# Altium project SmallKeyboard_Project.PrjPcb
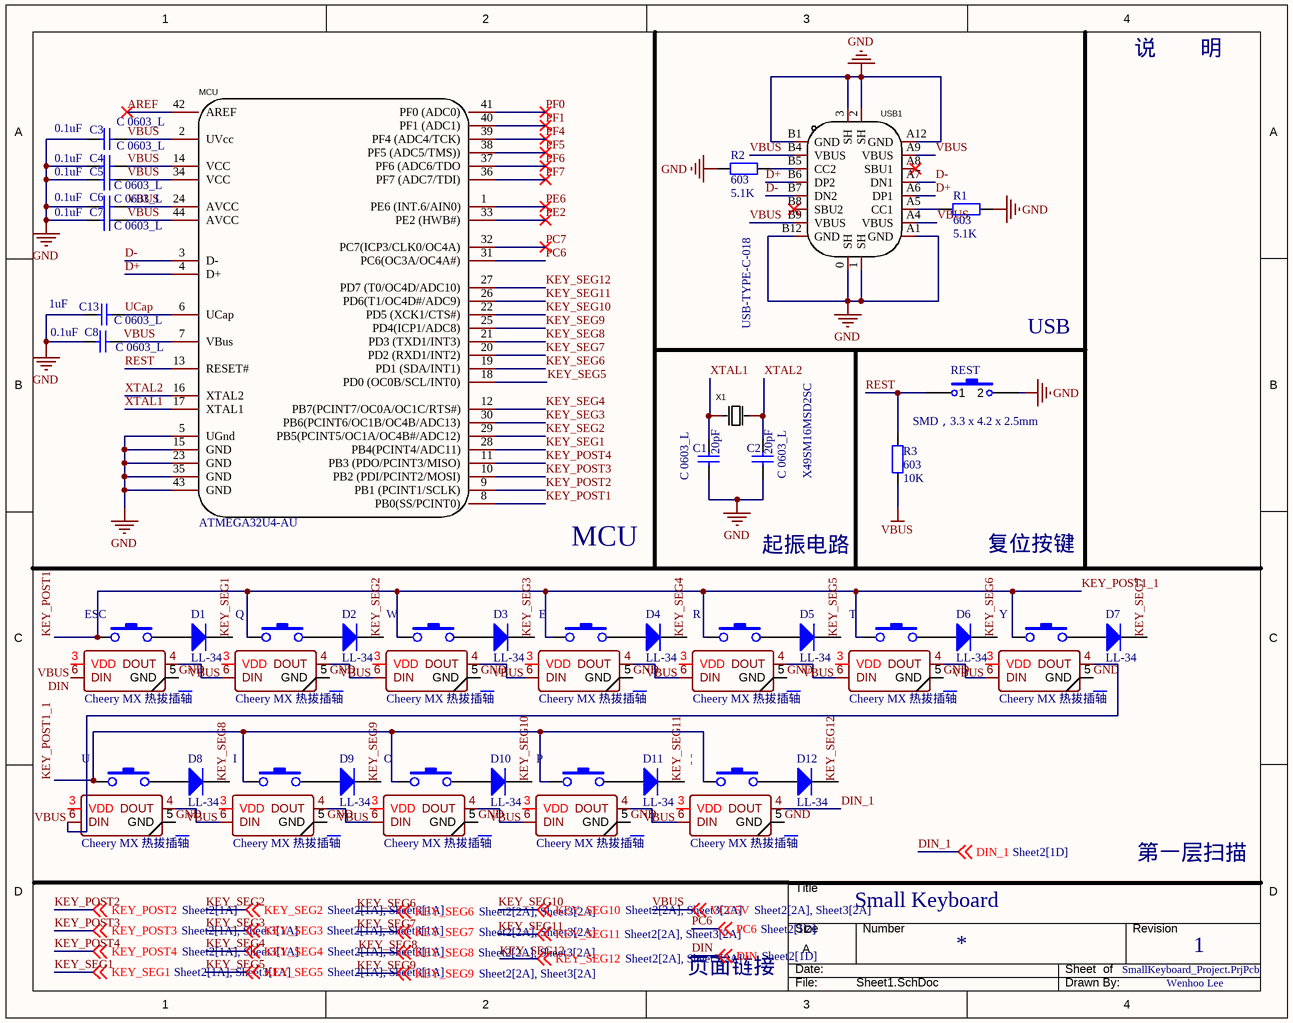
[diagram p0: Sheet1.SchDoc]
3 sheets, 114 parts. Net scope: global (net labels, ports and power ports of the same name join across sheets).
Board file: PCB1.PcbDoc
Sheets:
  Sheet1.SchDoc
  Sheet2.SchDoc
  Sheet3.SchDoc

## Sheet Sheet1.SchDoc: Small Keyboard
size A; ApprovedBy: Wenhoo Lee; CheckedBy: Wenhoo Lee; Author: Wenhoo Lee; CompanyName: Coreduino; DrawnBy: Wenhoo Lee; Engineer: Wenhoo Lee; Organization: Coreduino; Address1: Shandong; Address2: Taian; Address3: Dongping; Address4: Wangshan No.03; DocumentNumber: 1; Revision: 1; SheetNumber: 1; SheetTotal: 2

### Parts
C1  C 0603_L  value 20pF  [C 0603_L]
C2  C 0603_L  value 20pF  [C 0603_L]
C3  C 0603_L  value 0.1uF  [C 0603_L]
C4  C 0603_L  value 0.1uF  [C 0603_L]
C5  C 0603_L  value 0.1uF  [C 0603_L]
C6  C 0603_L  value 0.1uF  [C 0603_L]
C7  C 0603_L  value 0.1uF  [C 0603_L]
C8  C 0603_L  value 0.1uF  [C 0603_L]
C13  C 0603_L  value 1uF  [C 0603_L]
D1  LL-34  [LL-34_L3.7-W1.6-RD]
D2  LL-34  [LL-34_L3.7-W1.6-RD]
D3  LL-34  [LL-34_L3.7-W1.6-RD]
D4  LL-34  [LL-34_L3.7-W1.6-RD]
D5  LL-34  [LL-34_L3.7-W1.6-RD]
D6  LL-34  [LL-34_L3.7-W1.6-RD]
D7  LL-34  [LL-34_L3.7-W1.6-RD]
D8  LL-34  [LL-34_L3.7-W1.6-RD]
D9  LL-34  [LL-34_L3.7-W1.6-RD]
D10  LL-34  [LL-34_L3.7-W1.6-RD]
D11  LL-34  [LL-34_L3.7-W1.6-RD]
D12  LL-34  [LL-34_L3.7-W1.6-RD]
E  Cheery MX 热拔插轴  [MX_SW-HOTPLUG]
ESC  Cheery MX 热拔插轴  [MX_SW-HOTPLUG]
I  Cheery MX 热拔插轴  [MX_SW-HOTPLUG]
MCU  ATMEGA32U4-AU  [QFP-44_L10.0-W10.0-P0.80-LS13.2-BL]
O  Cheery MX 热拔插轴  [MX_SW-HOTPLUG]
P  Cheery MX 热拔插轴  [MX_SW-HOTPLUG]
Q  Cheery MX 热拔插轴  [MX_SW-HOTPLUG]
R  Cheery MX 热拔插轴  [MX_SW-HOTPLUG]
R1  603  value 5.1K  [0603P]
R2  603  value 5.1K  [0603P]
R3  603  value 10K  [R 0603_L]
REST  SMD，3.3 x 4.2 x 2.5mm  [SMD-3.2*4.2]
T  Cheery MX 热拔插轴  [MX_SW-HOTPLUG]
U  Cheery MX 热拔插轴  [MX_SW-HOTPLUG]
USB1  USB-TYPE-C-018  [USB-C_SMD-TYPE-C-31-M-12]
W  Cheery MX 热拔插轴  [MX_SW-HOTPLUG]
X1  X49SM16MSD2SC  [HC-49S_L11.4-W4.8]
Y  Cheery MX 热拔插轴  [MX_SW-HOTPLUG]
|  Cheery MX 热拔插轴  [MX_SW-HOTPLUG]

### Nets
GND: C1.1 C2.1 C3.1 C4.1 C5.1 C6.1 C7.1 C8.1 C13.1 E.5(GND) ESC.5(GND) I.5(GND) MCU.5(UGnd) MCU.15(GND) MCU.23(GND) MCU.35(GND) MCU.43(GND) O.5(GND) P.5(GND) Q.5(GND) R.5(GND) R1.2 R2.1 REST.2 T.5(GND) U.5(GND) USB1.0(SH) USB1.1(SH) USB1.2(SH) USB1.3(SH) USB1.A1(GND) USB1.A12(GND) USB1.B1(GND) USB1.B12(GND) W.5(GND) Y.5(GND) |.5(GND)
VBUS: C3.2 C4.2 C5.2 C6.2 C7.2 C8.2 E.3(VDD) ESC.3(VDD) I.3(VDD) MCU.2(UVcc) MCU.7(VBus) MCU.14(VCC) MCU.24(AVCC) MCU.34(VCC) MCU.44(AVCC) O.3(VDD) P.3(VDD) Q.3(VDD) R.3(VDD) R3.1 T.3(VDD) U.3(VDD) USB1.A4(VBUS) USB1.A9(VBUS) USB1.B4(VBUS) USB1.B9(VBUS) W.3(VDD) Y.3(VDD) |.3(VDD) ; off-sheet VCC5V  [also labelled VCC5V]
AREF: MCU.42(AREF)
D+: MCU.4(D+) USB1.A6(DP1) USB1.B6(DP2)
D-: MCU.3(D-) USB1.A7(DN1) USB1.B7(DN2)
DIN: ESC.6(DIN) ; off-sheet DIN
DIN_1: |.4(DOUT) ; off-sheet DIN_1
KEY_POST1: E.1 ESC.1 I.1 MCU.8(PB0(SS/PCINT0)) O.1 P.1 Q.1 R.1 T.1 U.1 W.1 Y.1 |.1  [also labelled KEY_POST1_1]
KEY_POST2: MCU.9(PB1_(PCINT1/SCLK)) ; off-sheet KEY_POST2
KEY_POST3: MCU.10(PB2_(PDI/PCINT2/MOSI)) ; off-sheet KEY_POST3
KEY_POST4: MCU.11(PB3_(PDO/PCINT3/MISO)) ; off-sheet KEY_POST4
KEY_SEG1: D1.2(K) MCU.28(PB4(PCINT4/ADC11)) ; off-sheet KEY_SEG1
KEY_SEG2: D2.2(K) MCU.29(PB5(PCINT5/OC1A/OC4B#/ADC12)) ; off-sheet KEY_SEG2
KEY_SEG3: D3.2(K) MCU.30(PB6(PCINT6/OC1B/OC4B/ADC13)) ; off-sheet KEY_SEG3
KEY_SEG4: D4.2(K) MCU.12(PB7(PCINT7/OC0A/OC1C/RTS#)) ; off-sheet KEY_SEG4
KEY_SEG5: D5.2(K) MCU.18(PD0_(OC0B/SCL/INT0)) ; off-sheet KEY_SEG5
KEY_SEG6: D6.2(K) MCU.19(PD1_(SDA/INT1)) ; off-sheet KEY_SEG6
KEY_SEG7: D7.2(K) MCU.20(PD2_(RXD1/INT2)) ; off-sheet KEY_SEG7
KEY_SEG8: D8.2(K) MCU.21(PD3_(TXD1/INT3)) ; off-sheet KEY_SEG8
KEY_SEG9: D9.2(K) MCU.25(PD4(ICP1/ADC8)) ; off-sheet KEY_SEG9
KEY_SEG10: D10.2(K) MCU.22(PD5_(XCK1/CTS#)) ; off-sheet KEY_SEG10
KEY_SEG11: D11.2(K) MCU.26(PD6(T1/OC4D#/ADC9)) ; off-sheet KEY_SEG11
KEY_SEG12: D12.2(K) MCU.27(PD7_(T0/OC4D/ADC10)) ; off-sheet KEY_SEG12
PC6: MCU.31(PC6(OC3A/OC4A#)) ; off-sheet PC6  [project net DIN_3V3_1(PC6)]
PC7: MCU.32(PC7(ICP3/CLK0/OC4A))
PE2: MCU.33(PE2_(HWB#))
PE6: MCU.1(PE6_(INT.6/AIN0))
PF0: MCU.41(PF0_(ADC0))
PF1: MCU.40(PF1_(ADC1))
PF4: MCU.39(PF4_(ADC4/TCK))
PF5: MCU.38(PF5_(ADC5/TMS)))
PF6: MCU.37(PF6_(ADC6/TDO)
PF7: MCU.36(PF7_(ADC7/TDI))
REST: MCU.13(RESET#) R3.2 REST.1
UCap: C13.2 MCU.6(UCap)
XTAL1: C1.2 MCU.17(XTAL1) X1.1(OSC1)
XTAL2: C2.2 MCU.16(XTAL2) X1.2(OSC2)
NetD1_1: D1.1(A) ESC.2
NetD2_1: D2.1(A) Q.2
NetD3_1: D3.1(A) W.2
NetD4_1: D4.1(A) E.2
NetD5_1: D5.1(A) R.2
NetD6_1: D6.1(A) T.2
NetD7_1: D7.1(A) Y.2
NetD8_1: D8.1(A) U.2
NetD9_1: D9.1(A) I.2
NetD10_1: D10.1(A) O.2
NetD11_1: D11.1(A) P.2
NetD12_1: D12.1(A) |.2
NetE_4: E.4(DOUT) R.6(DIN)
NetE_6: E.6(DIN) W.4(DOUT)
NetESC_4: ESC.4(DOUT) Q.6(DIN)
NetI_4: I.4(DOUT) O.6(DIN)
NetI_6: I.6(DIN) U.4(DOUT)
NetO_4: O.4(DOUT) P.6(DIN)
NetP_4: P.4(DOUT) |.6(DIN)
NetQ_4: Q.4(DOUT) W.6(DIN)
NetR1_1: R1.1 USB1.A5(CC1)
NetR2_2: R2.2 USB1.B5(CC2)
NetR_4: R.4(DOUT) T.6(DIN)
NetT_4: T.4(DOUT) Y.6(DIN)
NetU_6: U.6(DIN) Y.4(DOUT)

Not connected (* = marked no-connect by the designer): USB1 A8(SBU1)* B8(SBU2)*

### Notes on the sheet
- 说        明
- USB
- MCU
- 起振电路
- 复位按键
- 第一层扫描
- 页面链接
- DWG. NO.
- REV.
- SHT.
- REVISION
- DESCRIPTION
- DATE
- APPROVED
- THIS DOCUMENT AND THE DATA DISCLOSED HEREIN OR HEREWITH IS THE PROPERTY OF ALTIUM LIMITED AND MAY BE FREELY DISTRIBUTED IN WHOLE. NO RIGHTS ARE RESERVED OR EXPRESS OR IMPLIED WARANTEE GIVEN.
- ENG:
- DSN:
- APPROVALS
- PROJECT
- DOCUMENT REVISION:
- DESIGN ITEM:
- CHK:
- BOM:
- REFERENCE DOCUMENTS
- PROJECT REVISION:
- TITLE
- FAB DWG:
- PCB DWG:
- ASSY DWG:
- SCALE:
- SIZE
- C
- CAGE CODE
- FILE NAME
- DWG NO.
- SHEET
- OF
- REV

### Library data of the parts
C1-C8 C13 = C 0603_L: 贴片电容器（Capacitor）; Published: 8-Jun-2000; LatestRevisionDate: 17-Jul-2002; LatestRevisionNote: Re-released for DXP Platform.; PackageReference: RAD-0.3; Publisher: Altium Limited; PackageDescription: Radial Cap, Thru-Hole; 2 Leads; 0.3 in Pin Spacing
D1-D12 = LL4148: 开关二极管（Switching diode）; Published: 8-Jun-2000; LatestRevisionDate: 17-Jul-2002; LatestRevisionNote: Re-released for DXP Platform.; PackageVersion: Sep-1996; PackageReference: SMC; Publisher: Altium Limited; PackageDescription: DO-214-AB/SMC; 2 C-Bend Leads; Body 7.9 x 5.9 mm, inc. leads (LxW); Code_JEDEC: DO-214-AB
E ESC I O P Q R T U W Y | = Cheery MX 热拔插轴: 机械键盘轴（Cheery MX）
MCU = ATMEGA32U4-AU: MCU，ATMEGA32U4-AU; Manufacturer: MICROCHIP(美国微芯); Add into BOM: yes; CPU Core: AVR; Maximum Frequency: 16MHz; Supply Voltage Range: 2.7V~5.5V; Internal Oscillator: 有; Program FLASH Size: 16K@x16bit; RAM Size: 2.5KB; EEPROM/Data FLASH Size: 1KB; GPIO Ports Number: 26; ADC (Units/Channels/bits): 1@x12ch/10bit; Peripherals / Functions / Protocol Stacks: 欠压检测/复位；看门狗；POR；PWM; Name: ATMEGA32U4-AU; Symbol: ATMEGA32U4-AU; Device: ATMEGA32U4-AU; LCSC Part Name: AVR 16MHz 闪存：16K@x16bit RAM：2.5KB; Supplier Part: C44854; Manufacturer Part: ATMEGA32U4-AU; Supplier Footprint: QFP-44_10x10x08P; JLCPCB Part Class: Extended Part; Datasheet: https://atta.szlcsc.com/upload/public/pdf/source/20150811/1457707338800.pdf; Supplier: LCSC; Convert to PCB: yes; Operating Temperature Range: -40℃~+85℃
R1 R2 = R 0603_P: 贴片电阻（Resistor）; Published: 8-Jun-2000; LatestRevisionDate: 17-Jul-2002; LatestRevisionNote: Re-released for DXP Platform.; PackageReference: AXIAL-0.4; Publisher: Altium Limited; PackageDescription: Axial Device, Thru-Hole; 2 Leads; 0.4 in Pin Spacing
R3 = R 0603_L: 贴片电阻（Resistor）; Published: 8-Jun-2000; LatestRevisionDate: 17-Jul-2002; LatestRevisionNote: Re-released for DXP Platform.; PackageReference: AXIAL-0.4; Publisher: Altium Limited; PackageDescription: Axial Device, Thru-Hole; 2 Leads; 0.4 in Pin Spacing
REST = 260GF: 轻触开关（Touch Switch）; Published: 24-Mar-1999; LatestRevisionDate: 17-Jul-2002; LatestRevisionNote: Re-released for DXP Platform.; PackageReference: SPST-2; Publisher: Altium Limited; PackageDescription: Switch; 2 Leads
USB1 = USB-TYPE-C-018: 通用通信总线接口（USB）,16pin; Manufacturer: DEALON(德艺隆); Add into BOM: yes; Connector Type: Type-C; Gender: 母座; Number of Contacts: 16; Number of Ports: 1; Current Rating - Power (Max): 3A; Name: USB-TYPE-C-018; Symbol: USB-TYPE-C-018; Device: USB-TYPE-C-018; LCSC Part Name: USB-TYPE-C-018; Supplier Part: C2927038; Manufacturer Part: USB-TYPE-C-018; Supplier Footprint: SMD; JLCPCB Part Class: Extended Part; Datasheet: https://atta.szlcsc.com/upload/public/pdf/source/20211217/CCD3D517E355E8E0CC52ABD8D5784AD8.pdf; Supplier: LCSC; Convert to PCB: yes; Standard: -; Mounting Style: 卧贴; Operating Temperature Range: -25℃~+85℃
X1 = X49SM16MSD2SC: 无源晶振，2PIN; Manufacturer: YXC(扬兴晶振); Name: 16MHz; Add into BOM: yes; Crystal Type: 49SMD; Value: 16MHz; Frequency Tolerance: ±20ppm; Frequency Stability: ±30ppm; Load Capacitance: 20pF; Symbol: X49SM16MSD2SC; Device: X49SM16MSD2SC; LCSC Part Name: HC-49SMD 16MHz ±20ppm 20pF; Supplier Part: C12676; Manufacturer Part: X49SM16MSD2SC; Supplier Footprint: HC-49S-SMD-2P; JLCPCB Part Class: Extended Part; Datasheet: https://atta.szlcsc.com/upload/public/pdf/source/20210329/C106809_0E91E60850A780B284B63D653DC40EA4.pdf; Supplier: LCSC; Convert to PCB: yes; Operating Temperature: -20℃~+70℃

## Sheet Sheet2.SchDoc
size A4; SheetNumber: 2; SheetTotal: 3
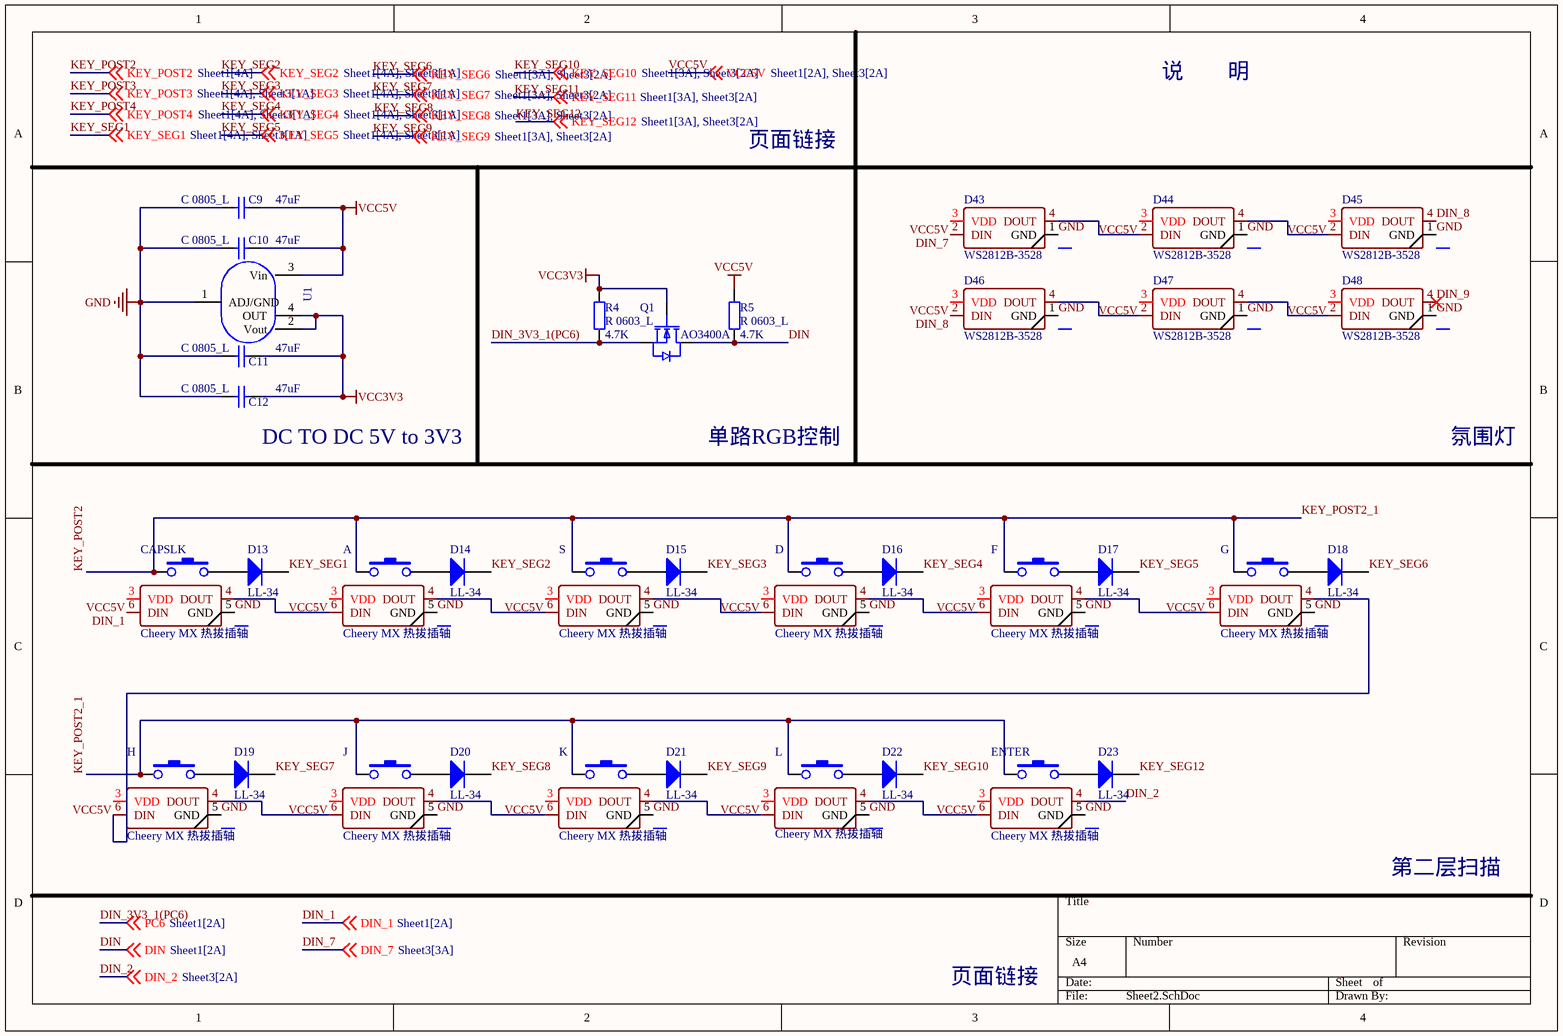
[diagram p1: Sheet2.SchDoc]

### Parts
A  Cheery MX 热拔插轴  [MX_SW-HOTPLUG]
C9  C 0805_L  value 47uF  [C 0805_L]
C10  C 0805_L  value 47uF  [C 0805_L]
C11  C 0805_L  value 47uF  [C 0805_L]
C12  C 0805_L  value 47uF  [C 0805_L]
CAPSLK  Cheery MX 热拔插轴  [MX_SW-HOTPLUG]
D  Cheery MX 热拔插轴  [MX_SW-HOTPLUG]
D13  LL-34  [LL-34_L3.7-W1.6-RD]
D14  LL-34  [LL-34_L3.7-W1.6-RD]
D15  LL-34  [LL-34_L3.7-W1.6-RD]
D16  LL-34  [LL-34_L3.7-W1.6-RD]
D17  LL-34  [LL-34_L3.7-W1.6-RD]
D18  LL-34  [LL-34_L3.7-W1.6-RD]
D19  LL-34  [LL-34_L3.7-W1.6-RD]
D20  LL-34  [LL-34_L3.7-W1.6-RD]
D21  LL-34  [LL-34_L3.7-W1.6-RD]
D22  LL-34  [LL-34_L3.7-W1.6-RD]
D23  LL-34  [LL-34_L3.7-W1.6-RD]
D43  WS2812B-3528  [WS2812B-3528，反贴RGBLED灯]
D44  WS2812B-3528  [WS2812B-3528，反贴RGBLED灯]
D45  WS2812B-3528  [WS2812B-3528，反贴RGBLED灯]
D46  WS2812B-3528  [WS2812B-3528，反贴RGBLED灯]
D47  WS2812B-3528  [WS2812B-3528，反贴RGBLED灯]
D48  WS2812B-3528  [WS2812B-3528，反贴RGBLED灯]
ENTER  Cheery MX 热拔插轴  [MX_SW-HOTPLUG]
F  Cheery MX 热拔插轴  [MX_SW-HOTPLUG]
G  Cheery MX 热拔插轴  [MX_SW-HOTPLUG]
H  Cheery MX 热拔插轴  [MX_SW-HOTPLUG]
J  Cheery MX 热拔插轴  [MX_SW-HOTPLUG]
K  Cheery MX 热拔插轴  [MX_SW-HOTPLUG]
L  Cheery MX 热拔插轴  [MX_SW-HOTPLUG]
Q1  AO3400A  [AO3400A]
R4  R 0603_L  value 4.7K  [R 0603_L]
R5  R 0603_L  value 4.7K  [R 0603_L]
S  Cheery MX 热拔插轴  [MX_SW-HOTPLUG]
U1  SPX1117M3-L-3-3  [SPX1117M3-L-3-3/TR]  (value not drawn)

### Nets
GND: A.5(GND) C9.1 C10.1 C11.1 C12.1 CAPSLK.5(GND) D.5(GND) D43.1(GND) D44.1(GND) D45.1(GND) D46.1(GND) D47.1(GND) D48.1(GND) ENTER.5(GND) F.5(GND) G.5(GND) H.5(GND) J.5(GND) K.5(GND) L.5(GND) S.5(GND) U1.1(ADJ/GND)
VCC3V3: C11.2 C12.2 Q1.1(G) R4.2 U1.2(Vout) U1.4(OUT)
VCC5V: A.3(VDD) C9.2 C10.2 CAPSLK.3(VDD) D.3(VDD) D43.3(VDD) D44.3(VDD) D45.3(VDD) D46.3(VDD) D47.3(VDD) D48.3(VDD) ENTER.3(VDD) F.3(VDD) G.3(VDD) H.3(VDD) J.3(VDD) K.3(VDD) L.3(VDD) R5.2 S.3(VDD) U1.3(Vin) ; off-sheet VCC5V  [project net VBUS]
DIN: Q1.3(D) R5.1 ; off-sheet DIN
DIN_1: CAPSLK.6(DIN) ; off-sheet DIN_1
DIN_2: ENTER.4(DOUT) ; off-sheet DIN_2
DIN_3V3_1(PC6): Q1.2(S) R4.1 ; off-sheet PC6  [also labelled PC6]
DIN_7: D43.2(DIN) ; off-sheet DIN_7
DIN_8: D45.4(DOUT) D46.2(DIN)
DIN_9: D48.4(DOUT)
KEY_POST2: A.1 CAPSLK.1 D.1 ENTER.1 F.1 G.1 H.1 J.1 K.1 L.1 S.1 ; off-sheet KEY_POST2  [also labelled KEY_POST2_1]
KEY_SEG1: D13.2(K) ; off-sheet KEY_SEG1
KEY_SEG2: D14.2(K) ; off-sheet KEY_SEG2
KEY_SEG3: D15.2(K) ; off-sheet KEY_SEG3
KEY_SEG4: D16.2(K) ; off-sheet KEY_SEG4
KEY_SEG5: D17.2(K) ; off-sheet KEY_SEG5
KEY_SEG6: D18.2(K) ; off-sheet KEY_SEG6
KEY_SEG7: D19.2(K) ; off-sheet KEY_SEG7
KEY_SEG8: D20.2(K) ; off-sheet KEY_SEG8
KEY_SEG9: D21.2(K) ; off-sheet KEY_SEG9
KEY_SEG10: D22.2(K) ; off-sheet KEY_SEG10
KEY_SEG12: D23.2(K) ; off-sheet KEY_SEG12
NetA_2: A.2 D14.1(A)
NetA_4: A.4(DOUT) S.6(DIN)
NetA_6: A.6(DIN) CAPSLK.4(DOUT)
NetCAPSLK_2: CAPSLK.2 D13.1(A)
NetD15_1: D15.1(A) S.2
NetD17_1: D17.1(A) F.2
NetD18_1: D18.1(A) G.2
NetD19_1: D19.1(A) H.2
NetD20_1: D20.1(A) J.2
NetD21_1: D21.1(A) K.2
NetD22_1: D22.1(A) L.2
NetD23_1: D23.1(A) ENTER.2
NetD43_4: D43.4(DOUT) D44.2(DIN)
NetD44_4: D44.4(DOUT) D45.2(DIN)
NetD46_4: D46.4(DOUT) D47.2(DIN)
NetD47_4: D47.4(DOUT) D48.2(DIN)
NetD_2: D.2 D16.1(A)
NetD_4: D.4(DOUT) F.6(DIN)
NetD_6: D.6(DIN) S.4(DOUT)
NetENTER_6: ENTER.6(DIN) L.4(DOUT)
NetF_4: F.4(DOUT) G.6(DIN)
NetG_4: G.4(DOUT) H.6(DIN)
NetH_4: H.4(DOUT) J.6(DIN)
NetJ_4: J.4(DOUT) K.6(DIN)
NetK_4: K.4(DOUT) L.6(DIN)

### Notes on the sheet
- 说        明
- 页面链接
- (near C12) DC TO DC 5V to 3V3
- 单路RGB控制
- 氛围灯
- 第二层扫描

### Library data of the parts
A CAPSLK D ENTER F G H J K L S = Cheery MX 热拔插轴: 机械键盘轴（Cheery MX）
C9-C12 = C 0805_L: Capacitor; Published: 8-Jun-2000; LatestRevisionDate: 17-Jul-2002; LatestRevisionNote: Re-released for DXP Platform.; PackageReference: RAD-0.3; Publisher: Altium Limited; PackageDescription: Radial Cap, Thru-Hole; 2 Leads; 0.3 in Pin Spacing
D13-D23 = LL4148: 开关二极管（Switching diode）; Published: 8-Jun-2000; LatestRevisionDate: 17-Jul-2002; LatestRevisionNote: Re-released for DXP Platform.; PackageVersion: Sep-1996; PackageReference: SMC; Publisher: Altium Limited; PackageDescription: DO-214-AB/SMC; 2 C-Bend Leads; Body 7.9 x 5.9 mm, inc. leads (LxW); Code_JEDEC: DO-214-AB
D43-D48 = WS2812B-3528: WS2812B-3528,反贴LED，RGB灯
Q1 = 2N7002,215: Manufacturer: Nexperia(安世); Add into BOM: yes; Type: N沟道; Drain Source Voltage (Vdss): 60V; Continuous Drain Current (Id): 300mA; Power Dissipation (Pd): 830mW; Drain Source On Resistance (RDS(on)@Vgs,Id): 5Ω@10V,500mA; Gate Threshold Voltage (Vgs(th)@Id): 2.5V@250A; Symbol: 2N7002,215; Device: 2N7002,215; LCSC Part Name: N沟道 60V 300mA; Supplier Part: C65189; Manufacturer Part: 2N7002,215; Supplier Footprint: SOT-23(SOT-23-3); JLCPCB Part Class: Extended Part; Datasheet: https://atta.szlcsc.com/upload/public/pdf/source/20170103/1483439882638.pdf; Supplier: LCSC; Convert to PCB: yes
R4 R5 = R 0603_L: Resistor; Published: 8-Jun-2000; LatestRevisionDate: 17-Jul-2002; LatestRevisionNote: Re-released for DXP Platform.; PackageReference: AXIAL-0.4; Publisher: Altium Limited; PackageDescription: Axial Device, Thru-Hole; 2 Leads; 0.4 in Pin Spacing
U1 = SPX1117M3-L-3-3: Manufacturer: UTC(友顺); Symbol: LM317G-AA3-R; Add into BOM: yes; Output Type: 可调; Output Polarity: 正; Number of Outputs: 1; Maximum Input Voltage: 40V; Output Voltage: 1.3V~37V; Dropout Voltage: 5V@(10mA); Output Current: 1A; Device: LM317G-AA3-R; LCSC Part Name: Vin=40V Vout=1.3V~37V 1A; Supplier Part: C19651; Manufacturer Part: LM317G-AA3-R; Supplier Footprint: SOT-223; JLCPCB Part Class: Extended Part; Datasheet: https://atta.szlcsc.com/upload/public/pdf/source/20160416/1460799387250.pdf; Supplier: LCSC; Convert to PCB: yes

## Sheet Sheet3.SchDoc
size A4; SheetNumber: 3; SheetTotal: 3
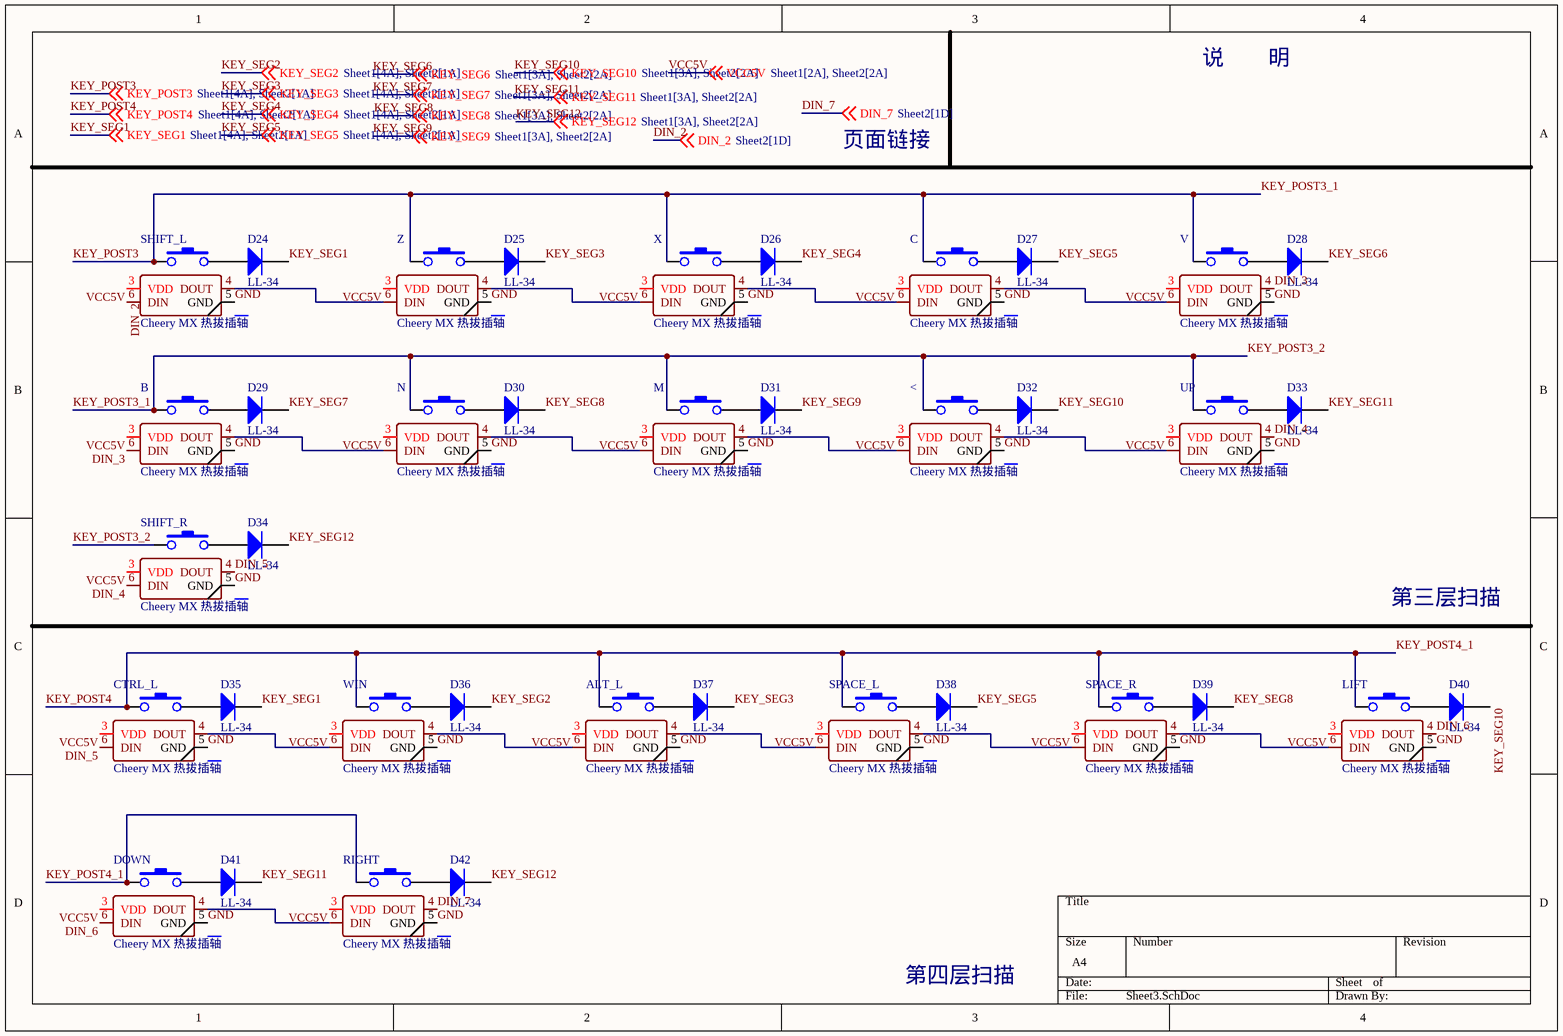
[diagram p2: Sheet3.SchDoc]

### Parts
<  Cheery MX 热拔插轴  [MX_SW-HOTPLUG]
ALT_L  Cheery MX 热拔插轴  [MX_SW-HOTPLUG]
B  Cheery MX 热拔插轴  [MX_SW-HOTPLUG]
C  Cheery MX 热拔插轴  [MX_SW-HOTPLUG]
CTRL_L  Cheery MX 热拔插轴  [MX_SW-HOTPLUG]
D24  LL-34  [LL-34_L3.7-W1.6-RD]
D25  LL-34  [LL-34_L3.7-W1.6-RD]
D26  LL-34  [LL-34_L3.7-W1.6-RD]
D27  LL-34  [LL-34_L3.7-W1.6-RD]
D28  LL-34  [LL-34_L3.7-W1.6-RD]
D29  LL-34  [LL-34_L3.7-W1.6-RD]
D30  LL-34  [LL-34_L3.7-W1.6-RD]
D31  LL-34  [LL-34_L3.7-W1.6-RD]
D32  LL-34  [LL-34_L3.7-W1.6-RD]
D33  LL-34  [LL-34_L3.7-W1.6-RD]
D34  LL-34  [LL-34_L3.7-W1.6-RD]
D35  LL-34  [LL-34_L3.7-W1.6-RD]
D36  LL-34  [LL-34_L3.7-W1.6-RD]
D37  LL-34  [LL-34_L3.7-W1.6-RD]
D38  LL-34  [LL-34_L3.7-W1.6-RD]
D39  LL-34  [LL-34_L3.7-W1.6-RD]
D40  LL-34  [LL-34_L3.7-W1.6-RD]
D41  LL-34  [LL-34_L3.7-W1.6-RD]
D42  LL-34  [LL-34_L3.7-W1.6-RD]
DOWN  Cheery MX 热拔插轴  [MX_SW-HOTPLUG]
LIFT  Cheery MX 热拔插轴  [MX_SW-HOTPLUG]
M  Cheery MX 热拔插轴  [MX_SW-HOTPLUG]
N  Cheery MX 热拔插轴  [MX_SW-HOTPLUG]
RIGHT  Cheery MX 热拔插轴  [MX_SW-HOTPLUG]
SHIFT_L  Cheery MX 热拔插轴  [MX_SW-HOTPLUG]
SHIFT_R  Cheery MX 热拔插轴  [MX_SW-HOTPLUG]
SPACE_L  Cheery MX 热拔插轴  [MX_SW-HOTPLUG]
SPACE_R  Cheery MX 热拔插轴  [MX_SW-HOTPLUG]
UP  Cheery MX 热拔插轴  [MX_SW-HOTPLUG]
V  Cheery MX 热拔插轴  [MX_SW-HOTPLUG]
WIN  Cheery MX 热拔插轴  [MX_SW-HOTPLUG]
X  Cheery MX 热拔插轴  [MX_SW-HOTPLUG]
Z  Cheery MX 热拔插轴  [MX_SW-HOTPLUG]

### Nets
GND: <.5(GND) ALT_L.5(GND) B.5(GND) C.5(GND) CTRL_L.5(GND) DOWN.5(GND) LIFT.5(GND) M.5(GND) N.5(GND) RIGHT.5(GND) SHIFT_L.5(GND) SHIFT_R.5(GND) SPACE_L.5(GND) SPACE_R.5(GND) UP.5(GND) V.5(GND) WIN.5(GND) X.5(GND) Z.5(GND)
VCC5V: <.3(VDD) ALT_L.3(VDD) B.3(VDD) C.3(VDD) CTRL_L.3(VDD) DOWN.3(VDD) LIFT.3(VDD) M.3(VDD) N.3(VDD) RIGHT.3(VDD) SHIFT_L.3(VDD) SHIFT_R.3(VDD) SPACE_L.3(VDD) SPACE_R.3(VDD) UP.3(VDD) V.3(VDD) WIN.3(VDD) X.3(VDD) Z.3(VDD) ; off-sheet VCC5V  [project net VBUS]
DIN_2: SHIFT_L.6(DIN) ; off-sheet DIN_2
DIN_3: B.6(DIN) V.4(DOUT)
DIN_4: SHIFT_R.6(DIN) UP.4(DOUT)
DIN_5: CTRL_L.6(DIN) SHIFT_R.4(DOUT)
DIN_6: DOWN.6(DIN) LIFT.4(DOUT)
DIN_7: RIGHT.4(DOUT) ; off-sheet DIN_7
KEY_POST3: <.1 B.1 C.1 M.1 N.1 SHIFT_L.1 SHIFT_R.1 UP.1 V.1 X.1 Z.1 ; off-sheet KEY_POST3  [also labelled KEY_POST3_1, KEY_POST3_2]
KEY_POST4: ALT_L.1 CTRL_L.1 DOWN.1 LIFT.1 RIGHT.1 SPACE_L.1 SPACE_R.1 WIN.1 ; off-sheet KEY_POST4  [also labelled KEY_POST4_1]
KEY_SEG1: D24.2(K) D35.2(K) ; off-sheet KEY_SEG1
KEY_SEG2: D36.2(K) ; off-sheet KEY_SEG2
KEY_SEG3: D25.2(K) D37.2(K) ; off-sheet KEY_SEG3
KEY_SEG4: D26.2(K) ; off-sheet KEY_SEG4
KEY_SEG5: D27.2(K) D38.2(K) ; off-sheet KEY_SEG5
KEY_SEG6: D28.2(K) ; off-sheet KEY_SEG6
KEY_SEG7: D29.2(K) ; off-sheet KEY_SEG7
KEY_SEG8: D30.2(K) D39.2(K) ; off-sheet KEY_SEG8
KEY_SEG9: D31.2(K) ; off-sheet KEY_SEG9
KEY_SEG10: D32.2(K) D40.2(K) ; off-sheet KEY_SEG10
KEY_SEG11: D33.2(K) D41.2(K) ; off-sheet KEY_SEG11
KEY_SEG12: D34.2(K) D42.2(K) ; off-sheet KEY_SEG12
Net<_2: <.2 D32.1(A)
Net<_4: <.4(DOUT) UP.6(DIN)
Net<_6: <.6(DIN) M.4(DOUT)
NetALT_L_2: ALT_L.2 D37.1(A)
NetALT_L_4: ALT_L.4(DOUT) SPACE_L.6(DIN)
NetALT_L_6: ALT_L.6(DIN) WIN.4(DOUT)
NetB_2: B.2 D29.1(A)
NetB_4: B.4(DOUT) N.6(DIN)
NetC_2: C.2 D27.1(A)
NetC_4: C.4(DOUT) V.6(DIN)
NetC_6: C.6(DIN) X.4(DOUT)
NetCTRL_L_2: CTRL_L.2 D35.1(A)
NetCTRL_L_4: CTRL_L.4(DOUT) WIN.6(DIN)
NetD24_1: D24.1(A) SHIFT_L.2
NetD25_1: D25.1(A) Z.2
NetD26_1: D26.1(A) X.2
NetD28_1: D28.1(A) V.2
NetD30_1: D30.1(A) N.2
NetD31_1: D31.1(A) M.2
NetD33_1: D33.1(A) UP.2
NetD34_1: D34.1(A) SHIFT_R.2
NetD36_1: D36.1(A) WIN.2
NetD38_1: D38.1(A) SPACE_L.2
NetD39_1: D39.1(A) SPACE_R.2
NetD40_1: D40.1(A) LIFT.2
NetD41_1: D41.1(A) DOWN.2
NetD42_1: D42.1(A) RIGHT.2
NetDOWN_4: DOWN.4(DOUT) RIGHT.6(DIN)
NetLIFT_6: LIFT.6(DIN) SPACE_R.4(DOUT)
NetM_6: M.6(DIN) N.4(DOUT)
NetSHIFT_L_4: SHIFT_L.4(DOUT) Z.6(DIN)
NetSPACE_L_4: SPACE_L.4(DOUT) SPACE_R.6(DIN)
NetX_6: X.6(DIN) Z.4(DOUT)

### Notes on the sheet
- 说        明
- 页面链接
- 第三层扫描
- 第四层扫描

### Library data of the parts
< ALT_L B C CTRL_L DOWN LIFT M N RIGHT SHIFT_L SHIFT_R SPACE_L SPACE_R UP V WIN X Z = Cheery MX 热拔插轴: 机械键盘轴（Cheery MX）
D24-D42 = LL4148: 开关二极管（Switching diode）; Published: 8-Jun-2000; LatestRevisionDate: 17-Jul-2002; LatestRevisionNote: Re-released for DXP Platform.; PackageVersion: Sep-1996; PackageReference: SMC; Publisher: Altium Limited; PackageDescription: DO-214-AB/SMC; 2 C-Bend Leads; Body 7.9 x 5.9 mm, inc. leads (LxW); Code_JEDEC: DO-214-AB

## Nets that join several sheets
GND: Sheet1 (37 pins), Sheet2 (22 pins), Sheet3 (19 pins)
VBUS: Sheet1 (29 pins), Sheet2 (21 pins), Sheet3 (19 pins)
DIN: Sheet1 (ESC.6), Sheet2 (Q1.3 R5.1)
DIN_1: Sheet1 (|.4), Sheet2 (CAPSLK.6)
DIN_2: Sheet2 (ENTER.4), Sheet3 (SHIFT_L.6)
DIN_3V3_1(PC6): Sheet1 (MCU.31), Sheet2 (Q1.2 R4.1)
DIN_7: Sheet2 (D43.2), Sheet3 (RIGHT.4)
KEY_POST2: Sheet1 (MCU.9), Sheet2 (11 pins)
KEY_POST3: Sheet1 (MCU.10), Sheet3 (11 pins)
KEY_POST4: Sheet1 (MCU.11), Sheet3 (8 pins)
KEY_SEG1: Sheet1 (D1.2 MCU.28), Sheet2 (D13.2), Sheet3 (D24.2 D35.2)
KEY_SEG2: Sheet1 (D2.2 MCU.29), Sheet2 (D14.2), Sheet3 (D36.2)
KEY_SEG3: Sheet1 (D3.2 MCU.30), Sheet2 (D15.2), Sheet3 (D25.2 D37.2)
KEY_SEG4: Sheet1 (D4.2 MCU.12), Sheet2 (D16.2), Sheet3 (D26.2)
KEY_SEG5: Sheet1 (D5.2 MCU.18), Sheet2 (D17.2), Sheet3 (D27.2 D38.2)
KEY_SEG6: Sheet1 (D6.2 MCU.19), Sheet2 (D18.2), Sheet3 (D28.2)
KEY_SEG7: Sheet1 (D7.2 MCU.20), Sheet2 (D19.2), Sheet3 (D29.2)
KEY_SEG8: Sheet1 (D8.2 MCU.21), Sheet2 (D20.2), Sheet3 (D30.2 D39.2)
KEY_SEG9: Sheet1 (D9.2 MCU.25), Sheet2 (D21.2), Sheet3 (D31.2)
KEY_SEG10: Sheet1 (D10.2 MCU.22), Sheet2 (D22.2), Sheet3 (D32.2 D40.2)
KEY_SEG11: Sheet1 (D11.2 MCU.26), Sheet3 (D33.2 D41.2)
KEY_SEG12: Sheet1 (D12.2 MCU.27), Sheet2 (D23.2), Sheet3 (D34.2 D42.2)